# Altium schematic sheet MAIN.SchDoc
size A3; SheetNumber: 1; SheetTotal: 1
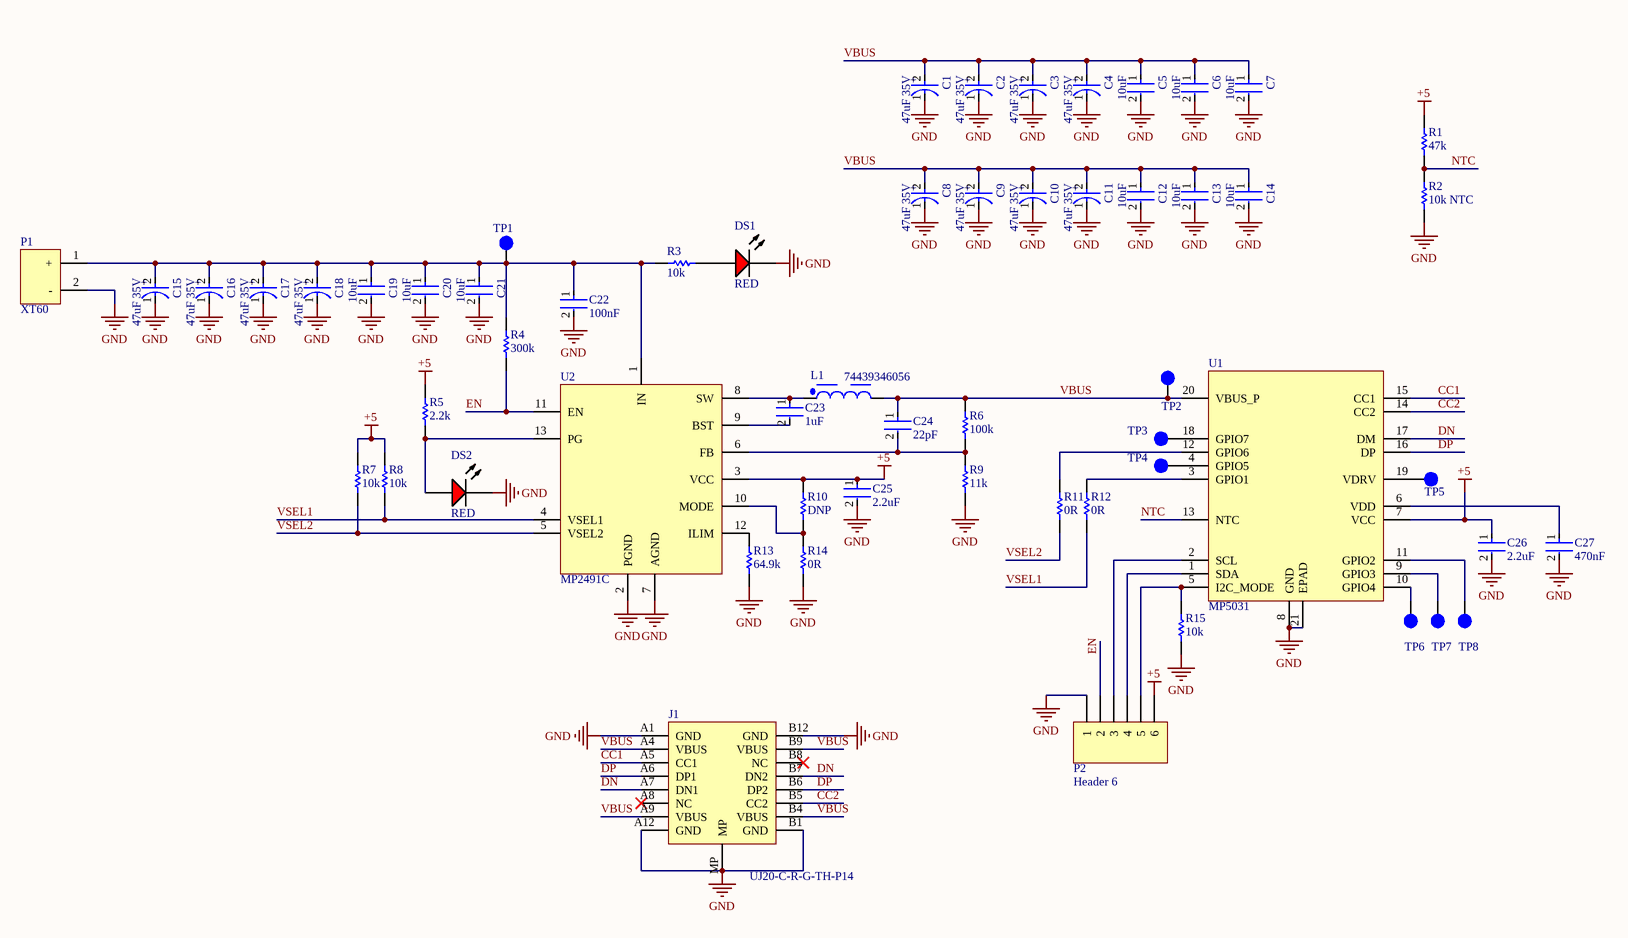
[diagram p0: MAIN.SchDoc]

## Parts
C1  47uF 35V  [FP-T491X476K035AT-MFG]
C2  47uF 35V  [FP-T491X476K035AT-MFG]
C3  47uF 35V  [FP-T491X476K035AT-MFG]
C4  47uF 35V  [FP-T491X476K035AT-MFG]
C5  10uF  [FP-1210-L_3_3_0_4-W_2_5_0-IPC_B]
C6  10uF  [FP-1210-L_3_3_0_4-W_2_5_0-IPC_B]
C7  10uF  [FP-1210-L_3_3_0_4-W_2_5_0-IPC_B]
C8  47uF 35V  [FP-T491X476K035AT-MFG]
C9  47uF 35V  [FP-T491X476K035AT-MFG]
C10  47uF 35V  [FP-T491X476K035AT-MFG]
C11  47uF 35V  [FP-T491X476K035AT-MFG]
C12  10uF  [FP-1210-L_3_3_0_4-W_2_5_0-IPC_B]
C13  10uF  [FP-1210-L_3_3_0_4-W_2_5_0-IPC_B]
C14  10uF  [FP-1210-L_3_3_0_4-W_2_5_0-IPC_B]
C15  47uF 35V  [FP-T491X476K035AT-MFG]
C16  47uF 35V  [FP-T491X476K035AT-MFG]
C17  47uF 35V  [FP-T491X476K035AT-MFG]
C18  47uF 35V  [FP-T491X476K035AT-MFG]
C19  10uF  [FP-1210-L_3_3_0_4-W_2_5_0-IPC_B]
C20  10uF  [FP-1210-L_3_3_0_4-W_2_5_0-IPC_B]
C21  10uF  [FP-1210-L_3_3_0_4-W_2_5_0-IPC_B]
C22  100nF  [FP-CGA3E-0_3-0_1-IPC_B]
C23  1uF  [FP-0603-L_1_6_0_15-W_0_81-IPC_B]
C24  22pF  [FP-C0603C-CF-IPC_B]
C25  2.2uF  [FP-GRM188-0_1-e0_2_0_5-IPC_B]
C26  2.2uF  [FP-GRM188-0_1-e0_2_0_5-IPC_B]
C27  470nF  [FP-C0603C-CF-IPC_B]
DS1  RED  [VISH-TLMX1100_V]
DS2  RED  [VISH-TLMX1100_V]
J1  UJ20-C-R-G-TH-P14  [UJ20-C-R-G-TH-P14]
L1  74439346056  [WE-XHMI_6060_L6.65W6.45H5.8]
P1  XT60  [XT60]
P2  Header 6  [HDR1X6]
R1  47k  [RESC1608X55X30NL15T15]
R2  10k NTC  [RESC1608X90X30NL15T20]
R3  10k  [RESC1609X55X30NL15T15]
R4  300k  [RESC1609X50X30NL10T20]
R5  2.2k  [RESC1608X50X30NL20T20]
R6  100k  [RESC1608X55X30NL15T15]
R7  10k  [RESC1609X55X30NL15T15]
R8  10k  [RESC1609X55X30NL15T15]
R9  11k  [RESC1609X50X30NL10T20]
R10  DNP  [RESC1608X55X25NL10T15]
R11  0R  [RESC1608X55X25NL10T15]
R12  0R  [RESC1608X55X25NL10T15]
R13  64.9k  [RESC1608X55X30NL15T15]
R14  0R  [RESC1608X55X25NL10T15]
R15  10k  [RESC1609X55X30NL15T15]
TP1  TESTPOINT  [TESTPOINT_0.6]  (value not drawn)
TP2  TESTPOINT  [TESTPOINT_0.6]  (value not drawn)
TP3  TESTPOINT  [TESTPOINT_0.6]  (value not drawn)
TP4  TESTPOINT  [TESTPOINT_0.6]  (value not drawn)
TP5  TESTPOINT  [TESTPOINT_0.6]  (value not drawn)
TP6  TESTPOINT  [TESTPOINT_0.6]  (value not drawn)
TP7  TESTPOINT  [TESTPOINT_0.6]  (value not drawn)
TP8  TESTPOINT  [TESTPOINT_0.6]  (value not drawn)
U1  MP5031  [QFN-20-MP5031]
U2  MP2491C  [QFN-13-MPS2491C]

## Nets
+5: C25.1 C26.1 P2.6 R1.2 R5.2 R7.2 R8.2 R10.2 U1.7(VCC) U2.3(VCC)
GND: C1.1(C) C2.1(C) C3.1(C) C4.1(C) C5.2 C6.2 C7.2 C8.1(C) C9.1(C) C10.1(C) C11.1(C) C12.2 C13.2 C14.2 C15.1(C) C16.1(C) C17.1(C) C18.1(C) C19.2 C20.2 C21.2 C22.2 C25.2 C26.2 C27.2 DS1.2(K) DS2.2(K) J1.A1(GND) J1.A12(GND) J1.B1(GND) J1.B12(GND) J1.MP P1.2(-) P2.1 R2.1 R9.1 R13.1 R14.1 R15.1 U1.8(GND) U1.21(EPAD) U2.2(PGND) U2.7(AGND)
CC1: J1.A5(CC1) U1.15(CC1)
CC2: J1.B5(CC2) U1.14(CC2)
DN: J1.A7(DN1) J1.B7(DN2) U1.17(DM)
DP: J1.A6(DP1) J1.B6(DP2) U1.16(DP)
EN: P2.2 R4.1 U2.11(EN)
NTC: R1.1 R2.2 U1.13(NTC)
VBUS: C1.2(A) C2.2(A) C3.2(A) C4.2(A) C5.1 C6.1 C7.1 C8.2(A) C9.2(A) C10.2(A) C11.2(A) C12.1 C13.1 C14.1 C24.1 J1.A4(VBUS) J1.A9(VBUS) J1.B4(VBUS) J1.B9(VBUS) L1.2 R6.2 TP2.1 U1.20(VBUS_P)
VSEL1: R8.1 R12.1 U2.4(VSEL1)
VSEL2: R7.1 R11.1 U2.5(VSEL2)
NetC15_2: C15.2(A) C16.2(A) C17.2(A) C18.2(A) C19.1 C20.1 C21.1 C22.1 P1.1(+) R3.2 R4.2 TP1.1 U2.1(IN)
NetC23_1: C23.1 L1.1 U2.8(SW)
NetC23_2: C23.2 U2.9(BST)
NetC24_2: C24.2 R6.1 R9.2 U2.6(FB)
NetC27_1: C27.1 U1.6(VDD)
NetDS1_1: DS1.1(A) R3.1
NetDS2_1: DS2.1(A) R5.1 U2.13(PG)
NetP2_3: P2.3 U1.2(SCL)
NetP2_4: P2.4 U1.1(SDA)
NetP2_5: P2.5 R15.2 U1.5(I2C_MODE)
NetR10_1: R10.1 R14.2 U2.10(MODE)
NetR11_2: R11.2 U1.12(GPIO6)
NetR12_2: R12.2 U1.3(GPIO1)
NetR13_2: R13.2 U2.12(ILIM)
NetTP3_1: TP3.1 U1.18(GPIO7)
NetTP4_1: TP4.1 U1.4(GPIO5)
NetTP5_1: TP5.1 U1.19(VDRV)
NetTP6_1: TP6.1 U1.10(GPIO4)
NetTP7_1: TP7.1 U1.9(GPIO3)
NetTP8_1: TP8.1 U1.11(GPIO2)

Not connected (* = marked no-connect by the designer): J1 A8(NC)* B8(NC)*

## Notes on the sheet
- (in symbol CMP-03017-000044-1) +

## Library data of the parts
C1-C4 C8-C11 C15-C18 = CMP-03017-000044-1: CAP TANT 47UF 10% 35V 2917; Ripple Current: 524mA; Polarity: Polar; Life (Hours): 2000Hour; Dissipation Factor: 8%; Leakage Current: 16.5uA; ESR (Equivalent Series Resistance): 600mR; Dielectric Material: Tantalum; Termination: SMD/SMT; Tolerance: 10%; Case Code (Metric): 7343; Radiation Hardening: No; Height: 4mm; Width: 4.3mm; Lead Free: Lead Free; Package Quantity: 1; Case Code (Imperial): 2917; Voltage Rating: 35V; Number of Pins: 2; Max Operating Temperature: 125°C; RoHS Compliant: Yes; Length: 7.3mm; Construction: Flat; Voltage Rating (DC): 35V; Capacitance: 47uF; Features: General Purpose; Voltage: 35V; REACH SVHC: No SVHC; Mount: Surface Mount; Series: T491; Case/Package: 2917; Height - Seated (Max): 0.169inch; Depth: 4.3mm; Packaging: Tape and Reel; Min Operating Temperature: -55°C
C5-C7 C12-C14 C19-C21 = CMP-2000-05477-2: General Purpose Ceramic Capacitor, 1210, 10uF, 10%, X5R, 15%, 25V; Lead Free: Lead Free; Max Operating Temperature: 85°C; REACH SVHC: No SVHC; Depth: 2.5mm; Packaging: Tape and Reel; Min Operating Temperature: -55°C; Height: 2.29mm; Construction: Flat; Case Code (Imperial): 1210; Radiation Hardening: No; Voltage: 25V; Case/Package: 1210; Series: -; Dielectric: X5R; Length: 3.2mm; Thickness: 0.11inch; Package Quantity: 1; Termination: SMD/SMT; Case Code (Metric): 3225; Voltage Rating (DC): 25V; Voltage Rating: 25V; Contact Plating: Tin; RoHS Compliant: Yes; Mount: Surface Mount; Width: 0.098inch; Capacitance: 10uF; Tolerance: 10%
C22 = CMP-2000-07546-2: Cap Ceramic 100nF 50V X7R 10% Pad SMD 0603 +125°C Automotive T/R; Weight: 7.1E-05oz; Composition: Ceramic; Max Operating Temperature: 125°C; Termination: SMD/SMT; Dielectric: X7R; Length: 1.6mm; Package Quantity: 1; REACH SVHC: No SVHC; Lead Free: Lead Free; Case Code (Metric): 1608; Min Operating Temperature: -55°C; Packaging: Tape and Reel; Tolerance: 10%; Voltage Rating: 50V; Case Code (Imperial): 0603; Capacitance: 100nF; Case/Package: 0603; Voltage Rating (DC): 50V; Depth: 0.8mm; Radiation Hardening: No; Ratings: AEC-Q200; Mount: Surface Mount; Voltage: 50V; Thickness: 0.035inch; Width: 0.8mm; Height: 0.8mm
C23 = CMP-2006-04532-2: General Purpose Ceramic Capacitor, 0603, 1uF, 10%, X5R, 15%, 16V; Dissipation Factor: 12.5%; Insulation Resistance: 10GR; Case/Package: 0603; Depth: 0.81mm; Max Operating Temperature: 85°C; Number of Pins: 2; Thickness: 0.035inch; Packaging: Tape and Reel; RoHS Compliant: Yes; Construction: Flat; Mount: Surface Mount; Width: 0.81mm; Case Code (Metric): 1608; Voltage Rating (DC): 16V; Voltage: 16V; Height: 0.9mm; Capacitance: 1uF; Length: 1.6mm; Dielectric: X5R; Voltage Rating: 16V; Radiation Hardening: No; Series: -; Case Code (Imperial): 0603; Tolerance: 10%; Lead Free: Lead Free; Termination: SMD/SMT; Min Operating Temperature: -55°C; Package Quantity: 1; REACH SVHC: No SVHC
C24 = CMP-2006-03119-3: Cap Ceramic 22pF 50V C0G 5% SMD 0603 125°C Paper T/R; Manufacturer Part Number: C0603C220J5GACTU; Manufacturer: KEMET; Temperature Coefficient: 30ppm/°C; Automotive Grade: Grade 1; Tolerance: 0.05; RoHS: TRUE; Temperature Characteristic: C0G; Capacitance: 22 pF; Device Class L3: Ceramic Capacitors; Digikey Description: Cap Ceramic 22pF 50V C0G 5% SMD 0603 125°C Paper T/R; ComponentLink2URL: https://api.kemet.com/component-edge/download/datasheet/C0603C100J5GACAUTO.pdf; ComponentLink2Description: Datasheet; Automotive: Yes; Temperature: -55°C to +125°C; Temperature Range High: +125°C; Package: C0603C-CF; Device Class L1: Passive Components; Device Class L2: Capacitors; Lead Free: Yes; Value: 22 pF; Category: Cap; Mouser Description: Cap Ceramic 22pF 50V C0G 5% SMD 0603 125°C Paper T/R; Voltage Rating: 50 V; Height: 0.87mm; Material: Ceramic; Temperature Range Low: -55°C; Octopart: https://octopart.com/c0603c220j5gactu-kemet-98525
C25 C26 = CMP-2006-02836-2: Chip Multilayer Ceramic Capacitors for General Purpose, 0603, 2.2uF, X7R, 15%, 10%, 10V; Case Code (Metric): 1608; Height: 0.8mm; Packaging: Cut Tape; Voltage: 10V; Lead Free: Lead Free; Min Operating Temperature: -55°C; Voltage Rating (DC): 10V; Max Operating Temperature: 125°C; Voltage Rating: 10V; Dielectric: X7R; Depth: 0.8mm; Case Code (Imperial): 0603; Termination: SMD/SMT; Case/Package: 0603; Number of Pins: 2; REACH SVHC: No SVHC; Mount: Surface Mount; Width: 0.031inch; Material: Ceramic; Capacitance: 2.2uF; Package Quantity: 1; Weight: 7.1E-05oz; Length: 1.6mm; Thickness: 0.035inch; Tolerance: 10%
C27 = CMP-2006-03235-2: CAP CER 0.47UF 16V X7R 0603; Manufacturer Part Number: C0603C474K4RACTU; Manufacturer: KEMET; Automotive Grade: Grade 1; Value: 0.47 μF; Tolerance: 0.1; Temperature Coefficient: 30ppm/°C; Material: Ceramic; Device Class L3: Ceramic Capacitors; ComponentLink2URL: https://api.kemet.com/component-edge/download/datasheet/C0603C100J5GACAUTO.pdf; Height: 0.87mm; ComponentLink2Description: Datasheet; Device Class L2: Capacitors; Temperature Range Low: -55°C; Temperature Range High: +125°C; RoHS: TRUE; Mouser Description: 0603 C 470nF Ceramic Multilayer Capacitor, 16 V, +125degC, X7R Dielec, +/-10%; Temperature Characteristic: X7R; Digikey Description: CAP CER 0.47UF 16V X7R 0603; Lead Free: Yes; Automotive: Yes; Octopart: https://octopart.com/c0603c474k4ractu-kemet-109683; Capacitance: 0.47 μF; Package: C0603C-CF; Voltage Rating: 16 V; Device Class L1: Passive Components; Category: Cap; Temperature: -55°C to +125°C
DS1 DS2 = CMP-1666-00027-1: LED, RED, 2.1 V, -40 to 100 degC, 2-Pin SMD (0603), RoHS, Tape and Reel; Type (Capacitors): C0G; Resistance: 100000000000 Ohm; Capacitance: 12 pF; Voltage Rating: 50 V; Tolerance: 5%; Min Operating Temperature: -55degC; REACH SVHC: No SVHC; ComponentLink2Description: Datasheet; ComponentLink1URL: http://www.vishay.com/; Width: 0.8 mm; Package Quantity: 4000; PackageReference: TLMX1100; ComponentLink2URL: http://www.vishay.com/docs/83173/tlmb1100.pdf; Case/Package: 0603; Case Code (Metric): 1608; Packaging: Tape and Reel; Pins: 2; ComponentLink1Description: Manufacturer URL; Max Operating Temperature: 125degC; Height: 0.8 mm; Length: 1.6 mm; Mount: Surface Mount; PackageDescription: 2-Pin Surface Mount Device, Body 1.6 x 0.8 mm; DatasheetVersion: Rev. 2.7, 03/2016; Case Code (Imperial): 0603; Voltage Rating (DC): 50 V; RoHSCompliant: True; Radiation Hardening: No
J1 = USB C
L1 = CMP-03913-75811201-1: 74439346056 Fixed Ind 5.6UH 6.9A 15MOHM SMD; Saturation Current: 5.8A; Inductance Tolerance: 20%; Inductance: 5.6µH; DC Resistance (DCR): 15mΩ; Width: 6.45mm; Length: 6.65mm; RMS Current (Irms): 6.9A; RoHS: Compliant; Height: 6.1mm; Mount: Surface Mount; Ambient Temperature Range Low: -40°C; Current Rating: 6.9A; REACH SVHC: No SVHC; Number of Pins: 2; Min Operating Temperature: -40°C; Ambient Temperature Range High: 85°C; NexarPartId: 75811201; Max Operating Temperature: 125°C
P2 = Header 6: Header, 6-Pin; LatestRevisionDate: 17-Jul-2002; LatestRevisionNote: Re-released for DXP Platform.; Publisher: Altium Limited
R1 = CMP-2000-00523-2: Chip Resistor, 47 KOhm, +/- 1%, 0.1 W, -55 to 155 degC, 0603 (1608 Metric), RoHS, Tape and Reel; Case\Package: 0603; Forward Current: 20 mA; Power Rating: 90 mW; Illumination Colour: Red; Nominal Vf: 2.1 V; Viewing Angle: 160 degrees; Luminous Intensity: 63 mcd; Lens Style: Clear; Nominal Wavelength: 639 nm; Case Code (Imperial): 0603; Case Code (Metric): 1608; Packaging: Tape and Reel; Radiation Hardening: No; Colour: Red; PackageDescription: 2-Pin Surface Mount Device, Body 1.6 x 0.85 mm; ComponentLink1Description: Manufacturer URL; Width: 0.8 mm; DatasheetVersion: Apr-15; ComponentLink2URL: http://industrial.panasonic.com/cdbs/www-data/pdf/RDA0000/AOA0000C86.pdf; Min Operating Temperature: -40 degC; Height: 0.6 mm; Package Quantity: 3000; ComponentLink2Description: Datasheet; REACH SVHC: No SVHC; ComponentLink1URL: http://www.panasonic.com/; Mount: Surface Mount; RoHSCompliant: true; Max Operating Temperature: 100 degC; PackageReference: 0603; Length: 1.6 mm; Forward Voltage: 2.1 V; Pins: 2
R2 = CMP-2000-00869-1: Part Number: ERT-J1VR103J; Manufacturer: Panasonic
R3 R7 R8 R15 = CMP-1012-00623-3: Chip Resistor, 10 KOhm, +/- 1%, 0.1 W, -55 to 155 degC, 0603 (1608 Metric), RoHS, Tape and Reel; Manufacturer: Panasonic; Voltage Rating: 75V; Case\/Package: 0603; Power Rating: 100mW; Resistance: 10KOhm; Temperature Coefficient: 100ppm\/degreesC; Number of Pins: 2; Package Reference: 603; Depth: 0.8mm; Mount: SurfaceMount; Package Description: 2-Pin Surface Mount Device, Body 1.6 x 0.85 mm; Datasheet Version: 02/2017; Length: 1.6mm; Lead Free: LeadFree; Height: 0.45mm; Number of Terminations: 2; Max Power Dissipation: 100mW; Min Operating Temperature: -55degC; Datasheet URL: https://industrial.panasonic.com/cdbs/www-data/pdf/RDA0000/AOA0000C304.pdf; Termination: SMD/SMT; Case Code (Metric): 1608; Case Code (Imperial): 0603; Tolerance: 1%; Max Operating Temperature: 155degC; RoHSCompliant: true; Voltage Rating (DC): 75V; Radiation Hardening: No; Packaging: TapeandReel; Composition: ThickFilm; Mounting Technology: SurfaceMount; Manufacturer URL: http://www.panasonic.com/; Width: 0.031inch; REACH SVHC: NoSVHC; Contact Plating: Tin; Military Standard: Not; Package Quantity: 1
R4 = CMP-2000-03214-1: Manufacturer: Vishay Dale; Part Number: CRCW0603300KFKEA
R5 = CMP-2000-02545-1: Part Number: RR0816P-223-B-T5; Manufacturer: Susumu
R6 = CMP-2000-00182-1: Part Number: ERJ-3EKF1003V; Manufacturer: Panasonic
R9 = CMP-2000-03860-1: Part Number: CRCW060311K0FKEA; Manufacturer: Vishay Dale
R10-R12 R14 = CMP-2100-03667-1: Chip Resistor, 0 Ohm, +/- 5%, 0.1 W, -55 to 155 degC, 0603 (1608 Metric), RoHS, Tape and Reel; Manufacturer: Yageo; Temperature Coefficient: 200ppm/degreesC; Voltage Rating: 50V; Power Rating: 100mW; Resistance: 0mOhm; Width: 0.8mm; Max Operating Temperature: 155degC; Tolerance: 5%; Package Reference: 0603; Height: 0.45mm; Depth: 0.8mm; Package Description: 2-Pin Surface Mount Device, Body 1.6 x 0.8 mm; Termination: SMD/SMT; Package Quantity: 5000; Case/Package: 0603; Case Code (Imperial): 0603; Radiation Hardening: No; Number of Pins: 2; Length: 1.6mm; Lead Free: LeadFree; Voltage Rating (DC): 50V; Military Standard: Not; Datasheet URL: http://www.yageo.com/NewPortal/yageodocoutput?fileName=/pdf/R-Chip/PYu-RC_Group_51_RoHS_L_5.pdf; Manufacturer URL: http://www.yageo.com/; Packaging: TapeandReel; Case Code (Metric): 1608; Min Operating Temperature: -55degC; Composition: ThickFilm; RoHSCompliant: true; Contact Plating: Tin; Datasheet Version: Rev. 5, 10/2016; REACH SVHC: NoSVHC
R13 = CMP-2000-00605-1: Part Number: ERJ-3EKF6492V; Manufacturer: Panasonic